# EAGLE schematic BSPD (EAGLE 9.2.1)
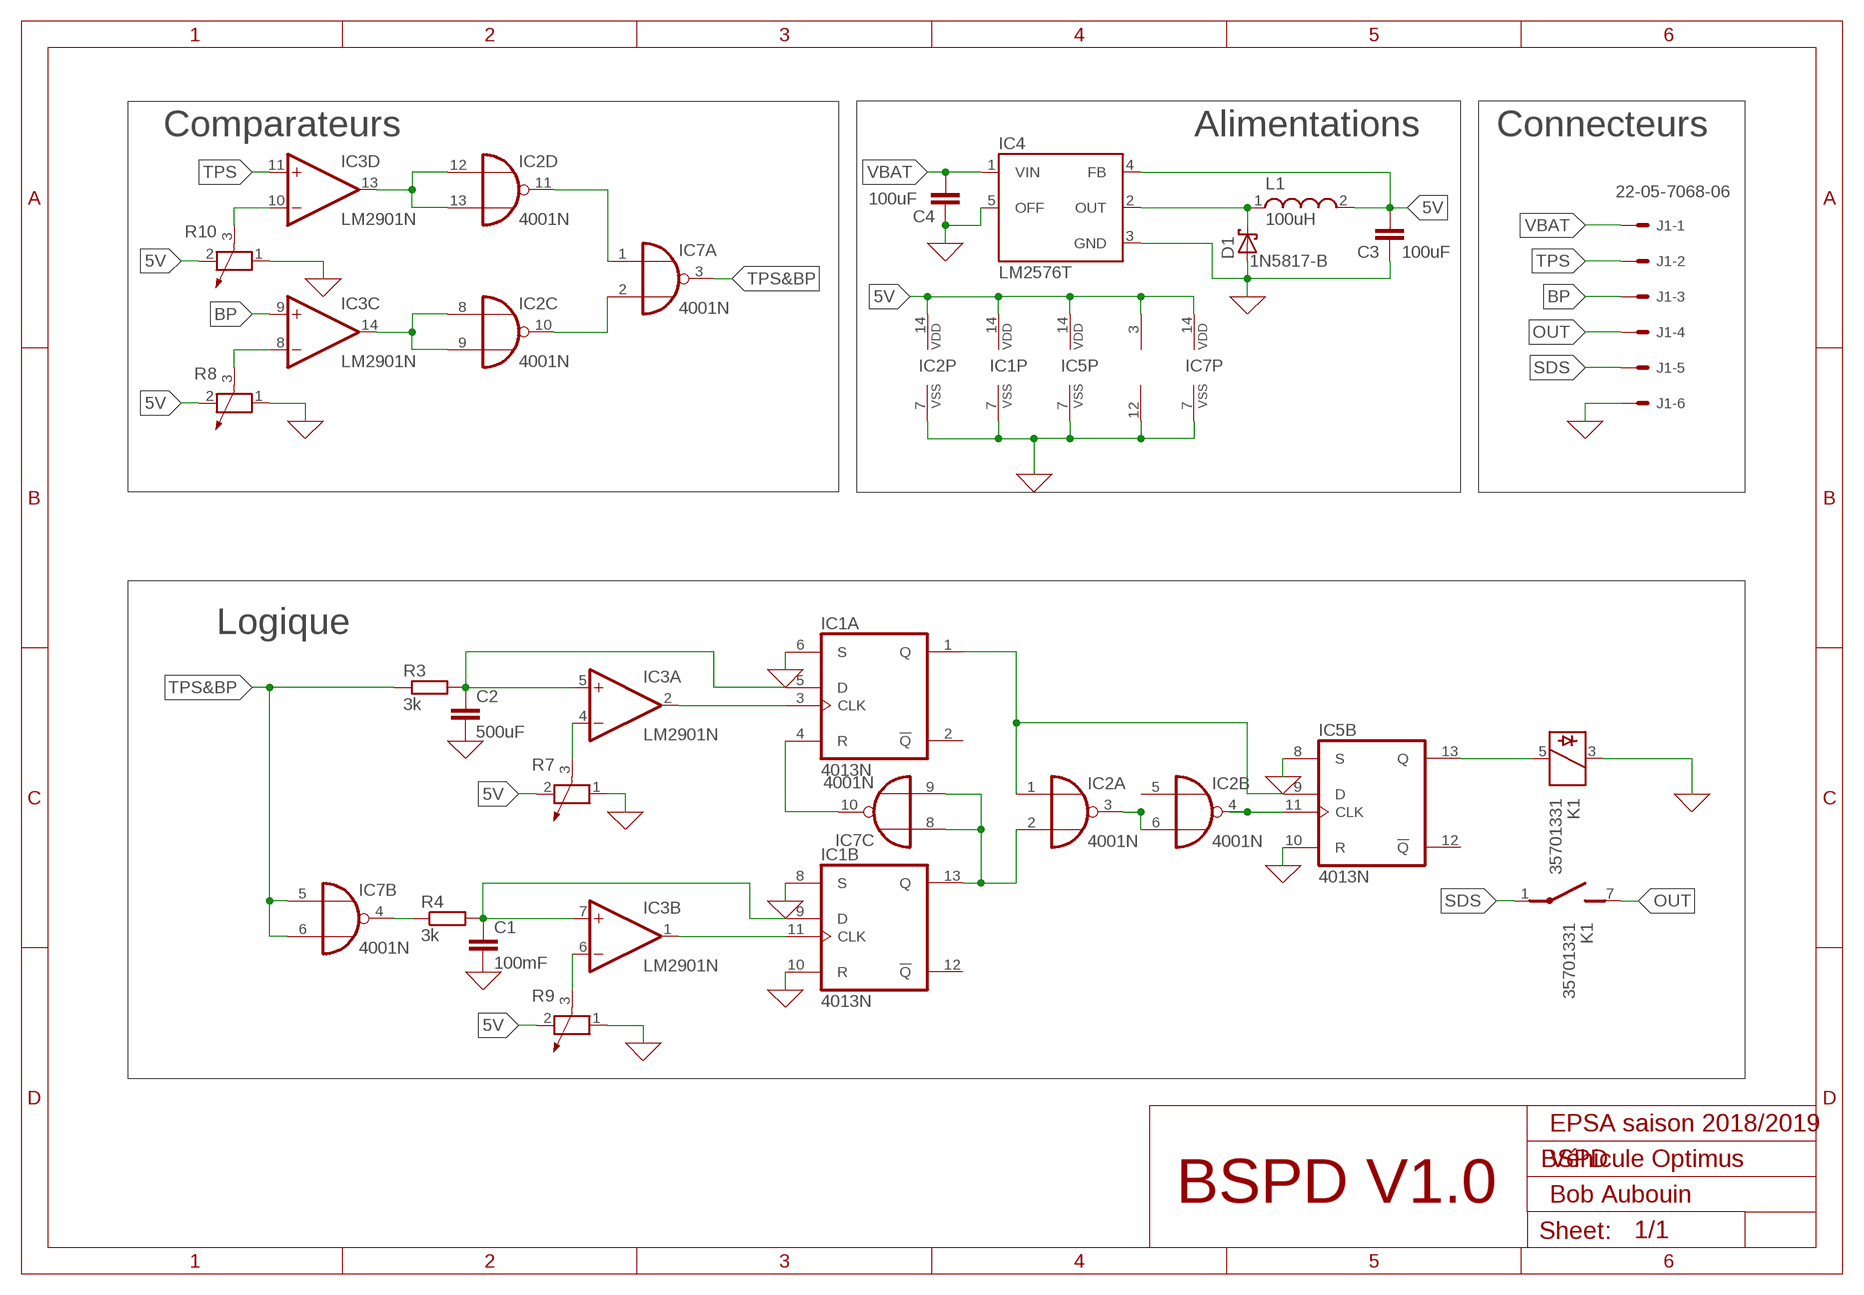
[diagram p0: schematic, sheet 1]

## Parts
C1  100mF  C-EU025-025X050  [C025-025X050]
C2  500uF  C-EU025-025X050  [C025-025X050]
C3  100uF  C-EU025-025X050  [C025-025X050]
C4  100uF  C-EU025-025X050  [C025-025X050]
D1  1N5817-B  [DO41-7.6]
IC1  4013N  [DIL14]
IC2  4001N  [DIL14]
IC3  LM2901N  [DIL14]
IC4  LM2576T  [TO220-5]
IC5  4013N  [DIL14]
IC7  4001N  [DIL14]
J1  22-05-7068-06  [7395-06]
K1  35701331  [REED]
L1  100uH  WE-TI_8012  [WE-TI_8012]
R3  3k  R-EU_0204/7  [0204/7]
R4  3k  R-EU_0204/7  [0204/7]
R7  POTENTIOMETER_PT_SPIN  [PT-SPIN]
R8  POTENTIOMETER_PT_SPIN  [PT-SPIN]
R9  POTENTIOMETER_PT_SPIN  [PT-SPIN]
R10  POTENTIOMETER_PT_SPIN  [PT-SPIN]

## Nets
0: C1.2 C2.2 C3.1 C4.1 D1.A IC1.6(A:S) IC1.7(P:VSS) IC1.8(B:S) IC1.10(B:R) IC2.7(P:VSS) IC3.12(P:V-) IC4.3(GND) IC4.5(OFF) IC5.7(P:VSS) IC5.8(B:S) IC5.10(B:R) IC7.7(P:VSS) J1.6 K1.3 R7.1 R8.1 R9.1 R10.1 ; supply symbol labelled GND
5V: C3.2 IC1.14(P:VDD) IC2.14(P:VDD) IC3.3(P:V+) IC4.4(FB) IC5.14(P:VDD) IC7.14(P:VDD) L1.2 R7.2 R8.2 R9.2 R10.2
BP: IC3.9(C:+IN) J1.3
N$1: C2.1 IC1.5(A:D) IC3.5(A:+IN) R3.2
N$2: IC3.4(A:-IN) R7.3
N$3: C1.1 IC1.9(B:D) IC3.7(B:+IN) R4.2
N$4: IC3.6(B:-IN) R9.3
N$5: IC1.11(B:CLK) IC3.1(B:OUT)
N$6: IC1.3(A:CLK) IC3.2(A:OUT)
N$7: IC2.12(D:I0) IC2.13(D:I1) IC3.13(D:OUT)
N$8: IC1.13(B:Q) IC2.2(A:I1) IC7.8(C:I0) IC7.9(C:I1)
N$9: IC1.1(A:Q) IC2.1(A:I0) IC5.9(B:D)
N$10: IC2.4(B:O) IC5.11(B:CLK)
N$11: IC7.4(B:O) R4.1
N$12: IC5.13(B:Q) K1.5
N$13: IC3.10(D:-IN) R10.3
N$14: IC3.8(C:-IN) R8.3
N$15: IC2.8(C:I0) IC2.9(C:I1) IC3.14(C:OUT)
N$16: D1.C IC4.2(OUT) L1.1
N$17: IC2.11(D:O) IC7.1(A:I0)
N$18: IC2.10(C:O) IC7.2(A:I1)
N$19: IC2.3(A:O) IC2.5(B:I0) IC2.6(B:I1)
N$21: IC1.4(A:R) IC7.10(C:O)
OUT: J1.4 K1.7(2:S)
SDS: J1.5 K1.1(2:P)
TPS: IC3.11(D:+IN) J1.2
TPS&BP: IC7.3(A:O) IC7.5(B:I0) IC7.6(B:I1) R3.1
VBAT: C4.2 IC4.1(VIN) J1.1
Unconnected: IC1.2(A:!Q) IC1.12(B:!Q) IC5.1(A:Q) IC5.2(A:!Q) IC5.3(A:CLK) IC5.4(A:R) IC5.5(A:D) IC5.6(A:S) IC5.12(B:!Q) IC7.11(D:O) IC7.12(D:I0) IC7.13(D:I1)

## Notes on the sheet
- Comparateurs | Alimentations | Connecteurs
- Logique
- EPSA saison 2018/2019
- Véhicule Optimus
- BSPD V1.0 | Bob Aubouin

## Library data of the parts
C1-C4 = rcl:C-EU: CAPACITOR, European symbol; SPICEPREFIX: C
D1 = diode:1N581*: 1.0A SCHOTTKY BARRIER RECTIFIER Source: http://www.diodes.com/datasheets/ds23001.pdf
IC1 IC5 = 40xx:4013: Dual D FLIP FLOP, set/reset
IC2 IC7 = 40xx:4001: Quad 2-input NOR
IC3 = linear:LM2901: COMPARATOR
IC4 = v-reg-3:LM2576: National Semiconductor <http://www.national.com> 3.0A "Simple Switcher"(c) 52kHz, Vout 1.23-37V (HV: 57V), Vin 40V (HV: 60V), 50µA standby current
J1 = con-molex:22-?-06: CONNECTOR wire to board 2.54 mm (.1 inch) pitch header; MF: MOLEX; OC_FARNELL: unknown; OC_NEWARK: unknown
K1 = relay:35701331: RELAY reed, 1 x norm. open with polarity; OC_FARNELL: unknown; OC_NEWARK: unknown
L1 = wurth_elektronik_passive_rev16d:WE-TI: Radial Leaded Wire Wound Inductor Characteristics Radial through-hole inductor High saturation core material Small size Maximum current up to 8.5 A Custom design on request Applications Signal filtering Switches, switching power supply for small and medium voltage Power supply filter EMI filter <http://katalog.we-online.de/media/images/eisos/IndTI_pf2.jpg> Details see: http://katalog.we-online.de/en/pbs/WE-TI? Updated by Dan Xu 2014-07-11 2014 (C) Wurth Elektronik
R3 R4 = rcl:R-EU_: RESISTOR, European symbol; SPICEPREFIX: R
R7-R10 = rcl:POTENTIOMETER_: Potentiometer; SPICEMODEL: POT; SPICEPREFIX: X